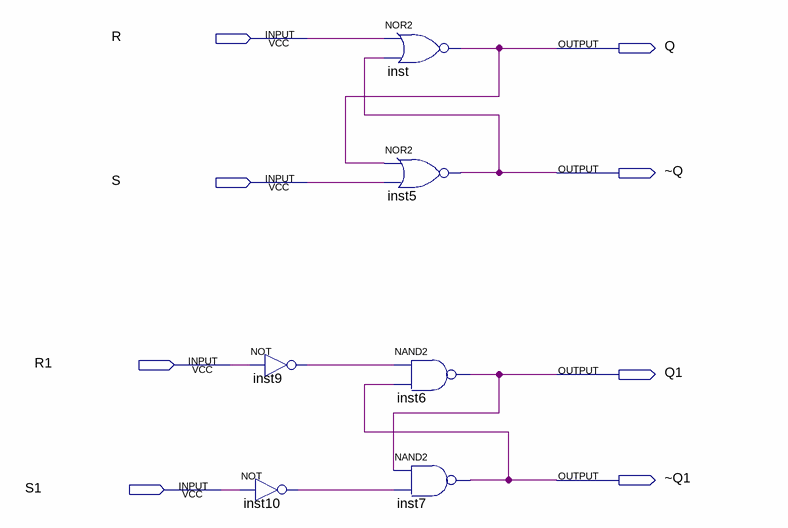
[diagram p0: schematic sheet]
// Quartus schematic lab9step1.bdf as structural Verilog: 6 symbols, 8 pins
module lab9step1 (
  input  R,
  input  S,
  input  R1,
  input  S1,
  output Q,
  output \~Q ,
  output Q1,
  output \~Q1 
);

  wire inst9_out, inst10_out;

  not inst9 (inst9_out, R1);
  not inst10 (inst10_out, S1);
  nor inst (Q, R, \~Q );
  nor inst5 (\~Q , Q, S);
  nand inst6 (Q1, inst9_out, \~Q1 );
  nand inst7 (\~Q1 , Q1, inst10_out);
endmodule
